# EasyEDA schematic HAM-Mission Control Full.json
TITLE: Sheet_1; REV: 1.0; Date: 2024-12-10; Sheet: 1/1; Drawn By: sgudi; Company: Your Company
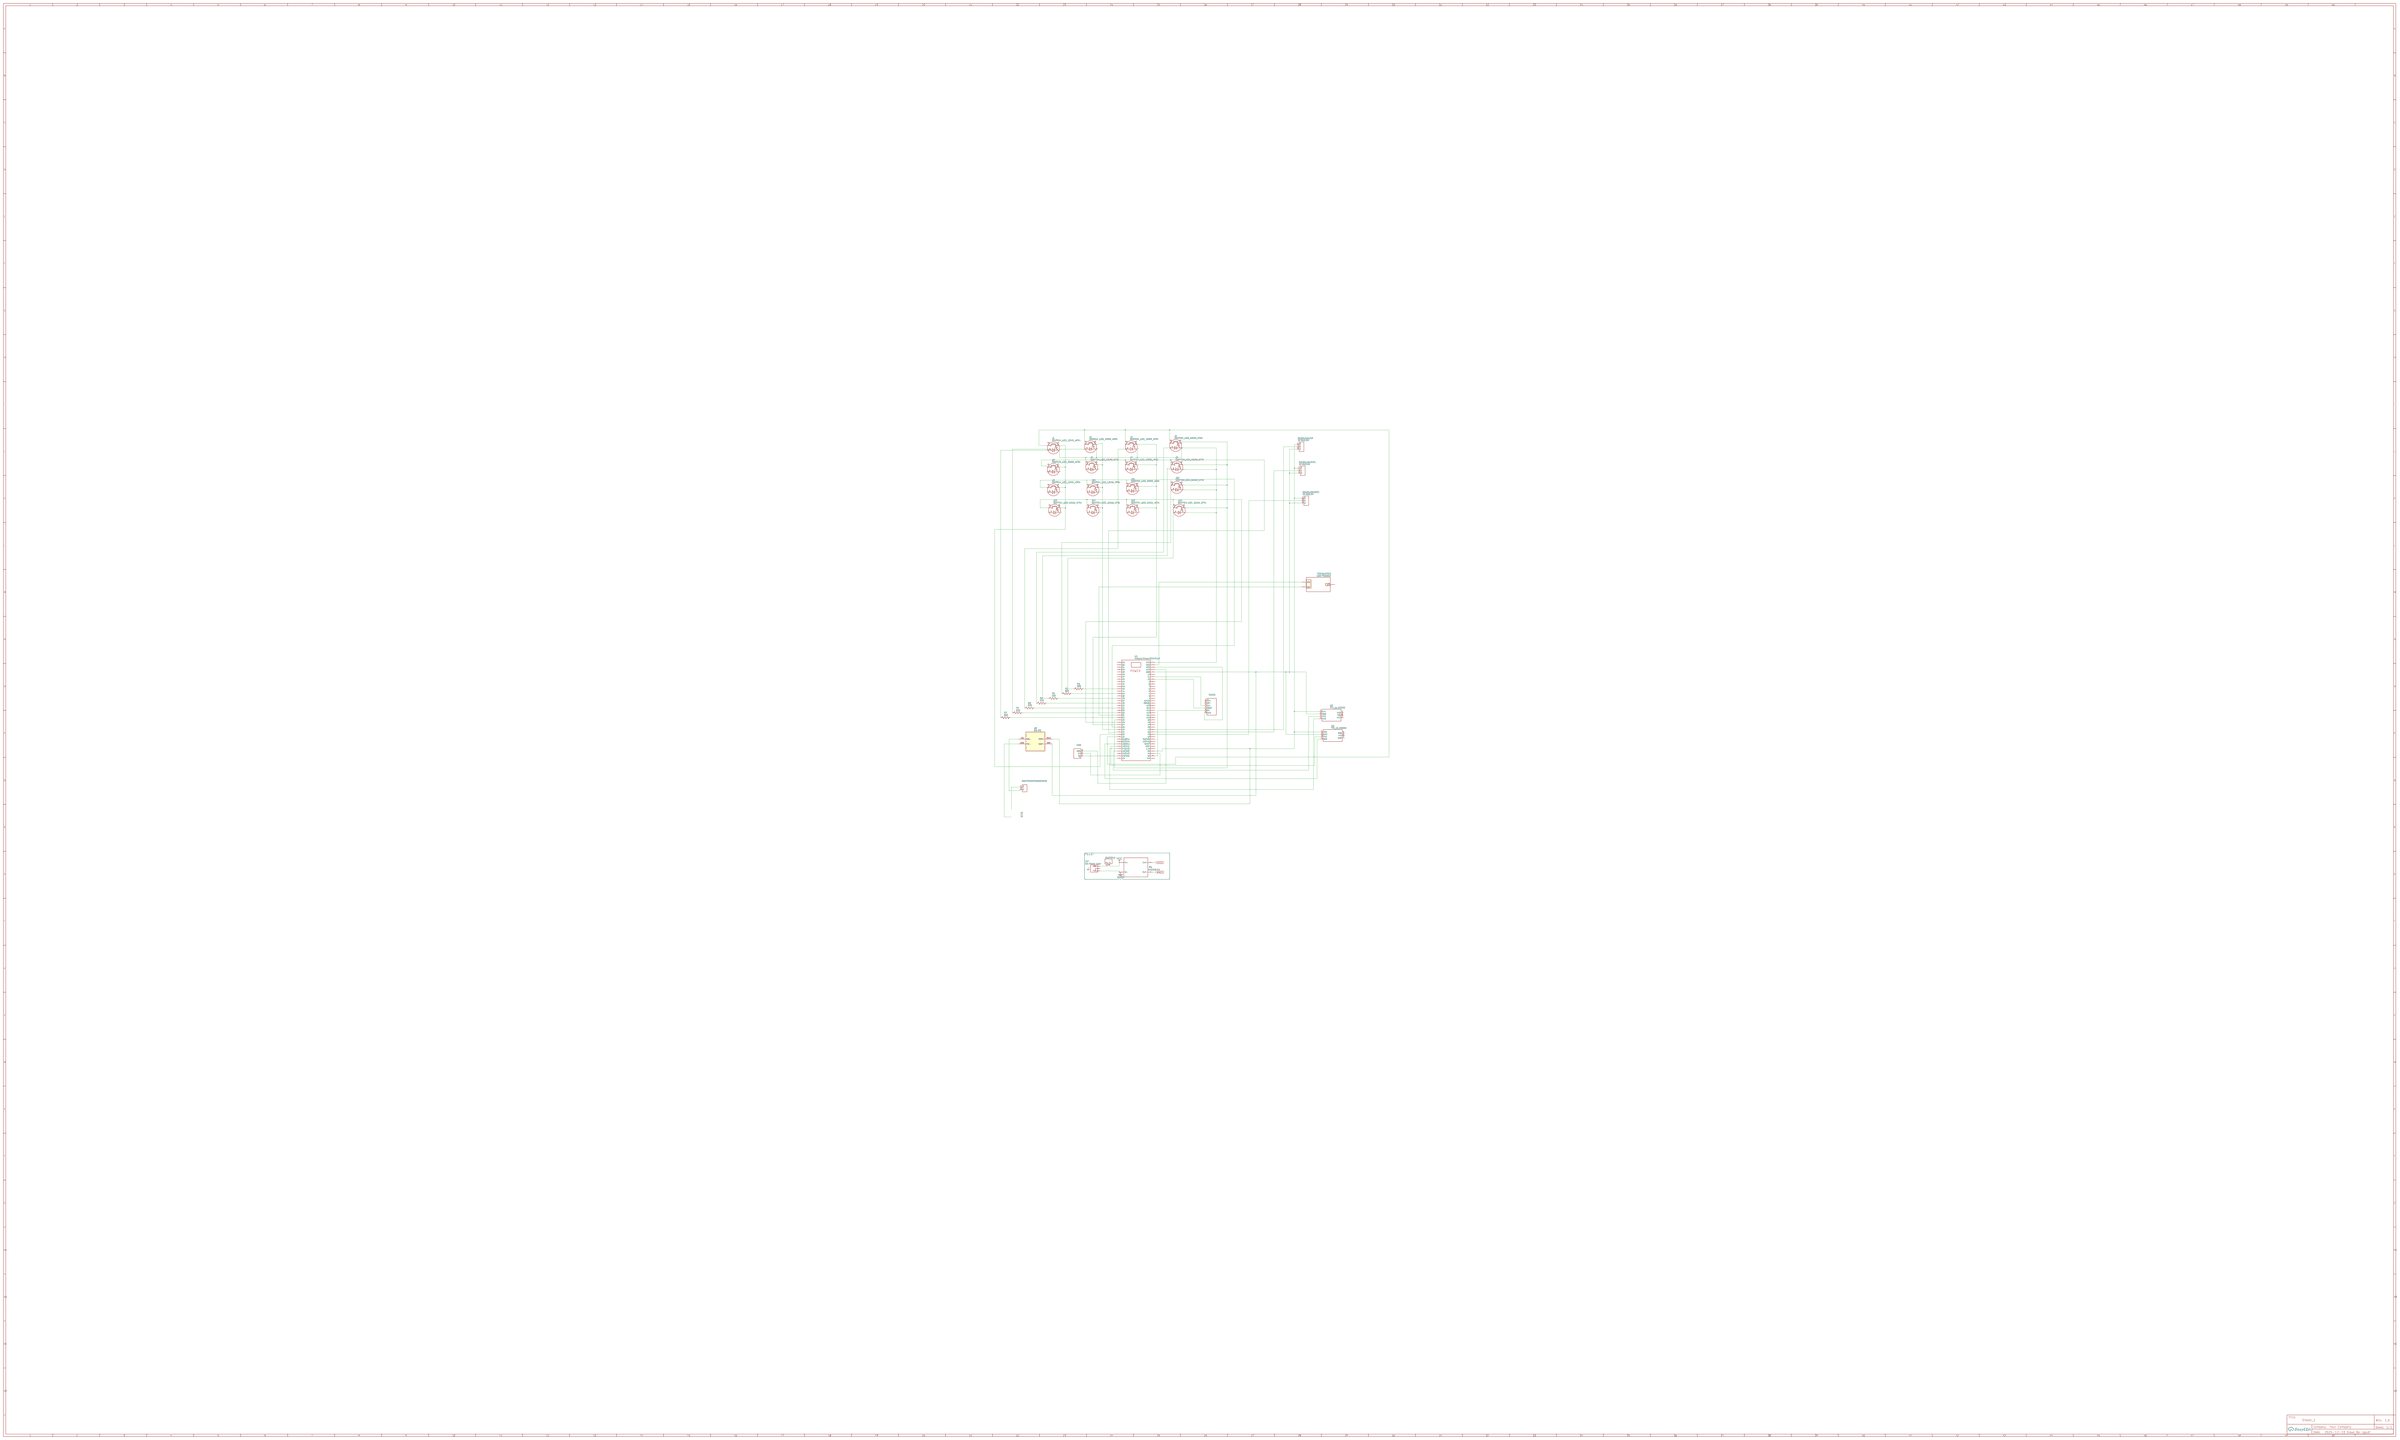
[diagram p0: schematic sheet]

## Parts
EMIC1  NO
J1  SWITCH_LED_16MM_4PIN  [SWITCH_LED_16MM_4PIN]
J2  SWITCH_LED_16MM_4PIN  [SWITCH_LED_16MM_4PIN]
J3  SWITCH_LED_16MM_4PIN  [SWITCH_LED_16MM_4PIN]
J4  SWITCH_LED_16MM_4PIN  [SWITCH_LED_16MM_4PIN]
J5  SWITCH_LED_16MM_4PIN  [SWITCH_LED_16MM_4PIN]
J6  SWITCH_LED_16MM_4PIN  [SWITCH_LED_16MM_4PIN]
J7  SWITCH_LED_16MM_4PIN  [SWITCH_LED_16MM_4PIN]
J8  SWITCH_LED_16MM_4PIN  [SWITCH_LED_16MM_4PIN]
J9  SWITCH_LED_16MM_4PIN  [SWITCH_LED_16MM_4PIN]
J10  SWITCH_LED_16MM_4PIN  [SWITCH_LED_16MM_4PIN]
J11  SWITCH_LED_16MM_4PIN  [SWITCH_LED_16MM_4PIN]
J12  SWITCH_LED_16MM_4PIN  [SWITCH_LED_16MM_4PIN]
J13  SWITCH_LED_16MM_4PIN  [SWITCH_LED_16MM_4PIN]
J14  SWITCH_LED_16MM_4PIN  [SWITCH_LED_16MM_4PIN]
J15  SWITCH_LED_16MM_4PIN  [SWITCH_LED_16MM_4PIN]
J16  SWITCH_LED_16MM_4PIN  [SWITCH_LED_16MM_4PIN]
J17  DC Power Jack  [VERTICAL_DC_POWER_JACK_SLOT]
LCD  NO
P2  LM2596 6V  [DC-DC-STEP-DOWN-LM2596]
PANELMOUNT  3P PH2.54  [CONN-TH_3P-P2.50_3PIN]
PANELMOUNT1  3P PH2.54  [CONN-TH_3P-P2.50_3PIN]
PANELMOUNT2  3P PH2.54  [CONN-TH_3P-P2.50_3PIN]
R1  820  [R0603]
R2  820  [R0603]
R3  820  [R0603]
R4  820  [R0603]
R5  820  [R0603]
R6  820  [R0603]
R7  820  [R0603]
SWITCH1  NO
SWITCHEATONMEXICO  NO
TOGGLERED  LED TOGGLE
U1  Arduino Mega 2560 Rev3  [ARDUINO MEGA 2560 REV3]
U2  TTL_to_RS232  [RS232_SP3232_TTL_TO_RS232_MODULE]
U3  TTL_to_RS232  [RS232_SP3232_TTL_TO_RS232_MODULE]
U5  DC-DC  [DC-DC36]

## Library data of the parts
J1-J16 = SWITCH_LED_16MM_4PIN: Manufacturer Part: 16mm LED; image: //image.lceda.cn/szlcsc/C60965.jpg; Contributor: Eddygwada2
J17 = 5.5MM x 2.1MM Female DC Power Jack 3Pin Panel Mount Connector with Dustproof Plug: CONN DC POWER JACK 2.1MM; Manufacturer Part: DC-005; Supplier: Lsgoodcare; Contributor: flyingpole
P2 = DC-DC-STEP-DOWN-LM2596: Contributor: Luis de Rivas
PANELMOUNT PANELMOUNT1 PANELMOUNT2 = 3P PH2.54: Contributor: LCSC; Supplier: LCSC; Supplier Part: C9900006188; JLCPCB Part Class: Extended Part
R1-R7 = R_0603_US: Contributor: LCEDA_Lib
TOGGLERED = LED TOGGLE: Manufacturer Part: RED; link: https://www.amazon.com/Support-Cover-Toggle-Switch-Pack/dp/B00ST2AHE0/ref=sr_1_2?ie=UTF8&qid=1504560720&sr=8-2&keywords=Red+Toggle+Switch; Contributor: tim.gilbert
U1 = Arduino Mega 2560 Rev3: Manufacturer: Arduino; Contributor: dominik.snopek
U2 U3 = TTL_to_RS232: Contributor: OffshoreOps
U5 = DC-DC: sourceId: eHPJDVP7p

## Nets
GND: J17.2(-) P2.IN-
GND(?): P2.OUT-
VCC: P2.IN+ SWITCH1.2
VCC(?): P2.OUT+
Net-(EMIC1-3): EMIC1.3(SIN) U1.11
Net-(EMIC1-4): EMIC1.4(SOUT) U1.10
Net-(EMIC1-5): EMIC1.5(5V) U1.5V@0(5V)
Net-(EMIC1-6): EMIC1.6(GND) U1.GND@2(GND)
Net-(J1-1): J1.1 J2.1 J3.1 J4.1 U1.22
Net-(J1-2): J1.2 J5.2 J9.2 J13.2 U1.23
Net-(J1-3): J1.3 R7.1
Net-(J1-4): J1.4 J2.4 J3.4 J4.4 J6.1 J8.4 J12.4 J16.4 U1.GND@4(GND)
Net-(J2-2): J2.2 J6.2 J10.2 J14.2 U1.25
Net-(J2-3): J2.3 R6.1
Net-(J3-2): J3.2 J7.2 J11.2 J15.2 U1.27
Net-(J3-3): J3.3 R5.1
Net-(J4-2): J4.2 J8.2 J12.2 J16.2 U1.29
Net-(J4-3): J4.3 R4.1
Net-(J5-1): J5.1 J7.1 J8.1 U1.24
Net-(J8-3): J8.3 R3.1
Net-(J9-1): J9.1 U1.26
Net-(J12-3): J12.3 R2.1
Net-(J13-1): J13.1 J14.1 J15.1 J16.1 U1.28
Net-(J16-3): J16.3 R1.1
Net-(J17-1): J17.1(+) SWITCH1.1
Net-(LCD-1): LCD.1(RX) U1.14(14(TX3))
Net-(LCD-2): LCD.2(5V) U1.5V@1(5V)
Net-(LCD-3): LCD.3(GND) U1.GND@1(GND)
Net-(PANELMOUNT1-2): PANELMOUNT1.2 U1.A4
Net-(PANELMOUNT2-2): PANELMOUNT2.2 U1.A3
Net-(PANELMOUNT-1): PANELMOUNT.1 PANELMOUNT1.1 PANELMOUNT2.1 U1.5V@2(5V) U2.1(VCC) U3.1(VCC) U5.VOUT(VOUT+)
Net-(PANELMOUNT-2): PANELMOUNT.2 U1.A5
Net-(PANELMOUNT-3): PANELMOUNT.3 PANELMOUNT1.3 PANELMOUNT2.3 U1.GND@0(GND) U2.2(GND) U3.2(GND) U5.GND(VOUT-)
Net-(R1-2): R1.2 U1.42
Net-(R2-2): R2.2 U1.40
Net-(R3-2): R3.2 U1.38
Net-(R4-2): R4.2 U1.36
Net-(R5-2): R5.2 U1.34
Net-(R6-2): R6.2 U1.32
Net-(R7-2): R7.2 U1.30
Net-(SWITCHEATONMEXICO-2): SWITCHEATONMEXICO.2 U5.VIN(VIN+)
Net-(TOGGLERED-1): TOGGLERED.1(off) U1.GND@3(GND)
Net-(TOGGLERED-2): TOGGLERED.2(12v) U1.31
Net-(U1-16): U1.16(16(TX2)) U2.3(TXD)
Net-(U1-17): U1.17(17(RX2)) U2.4(RXD)
Net-(U1-18): U1.18(18(TX1)) U3.3(TXD)
Net-(U1-19): U1.19(19(RX1)) U3.4(RXD)

Not connected (* = marked no-connect by the designer): EMIC1 1(SP+) 2(SP-); J5 3 4; J6 3 4; J7 3 4; J9 3 4; J10 1 3 4; J11 1 3 4; J12 1; J13 3 4; J14 3 4; J15 3 4; J17 3(GND2); SWITCHEATONMEXICO 1; U1 0(0(RX0)) 1(1(TX0)) 2 3 3.3V 4 5 6 7 8 9 12 13 15(15(RX3)) 20(20(SDA)) 21(21(SCL)) 33 35 37 39 41 43 44 45 46 47 48 49 50 51 52 53 A0(A0(RX0)) A1(A1(TX0)) A2 A6 A7 A8 A9 A10 A11 A12 A13 A14 A15 AREF RESET VIN; U2 5(RXD) 6(TXD) 7(GND); U3 5(RXD) 6(TXD) 7(GND)

## Notes on the sheet
- Power
